# EAGLE schematic TDA2003 (EAGLE 9.4.2)
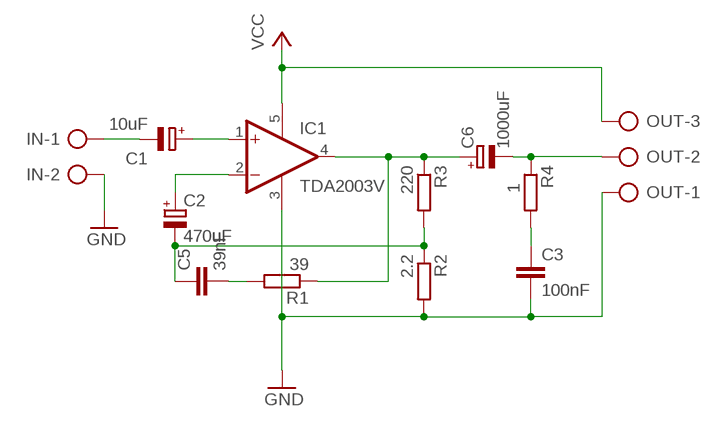
[diagram p0: schematic, sheet 1]

## Parts
C1  10uF  CPOL-EUE2.5-6  [E2,5-6]
C2  470uF  CPOL-EUE5-10.5  [E5-10,5]
C3  100nF  C-EU025-025X050  [C025-025X050]
C5  39nF  C-EU025-025X050  [C025-025X050]
C6  1000uF  CPOL-EUE5-13  [E5-13]
IC1  TDA2003V  [CB360]
IN  AK500/2-H  [AK500/2-H]
OUT  AK500/3-H  [AK500/3-H]
R1  39  R-EU_0207/10  [0207/10]
R2  2.2  R-EU_0207/10  [0207/10]
R3  220  R-EU_0207/10  [0207/10]
R4  1  R-EU_0207/10  [0207/10]

## Nets
GND: C3.2 IC1.3(GND) IN.2 OUT.1 R2.2
N$1: C1.+ IC1.1(+IN)
N$2: C1.- IN.1
N$3: C6.+ IC1.4(OUT) R1.1 R3.1
N$4: C6.- OUT.2 R4.1
N$5: C2.- C5.1 R2.1 R3.2
N$6: C3.1 R4.2
N$7: C2.+ IC1.2(-IN)
N$8: C5.2 R1.2
VCC: IC1.5(V+) OUT.3

## Library data of the parts
C1 C2 C6 = rcl:CPOL-EU: POLARIZED CAPACITOR, European symbol; SPICEPREFIX: C
C3 C5 = rcl:C-EU: CAPACITOR, European symbol; SPICEPREFIX: C
IC1 = linear:TDA2003: AUDIO AMPLIFIER
IN = con-ptr500:AK500/2-H: CONNECTOR Aug. 2004 / PTR Meßtechnik: Die Bezeichnung der Serie AK505 wurde geändert. Es handelt sich hierbei um AK500 in horizontaler Ausführung.; OC_FARNELL: unknown; OC_NEWARK: unknown
OUT = con-ptr500:AK500/3-H: CONNECTOR Aug. 2004 / PTR Meßtechnik: Die Bezeichnung der Serie AK505 wurde geändert. Es handelt sich hierbei um AK500 in horizontaler Ausführung.; OC_FARNELL: unknown; OC_NEWARK: unknown
R1-R4 = rcl:R-EU_: RESISTOR, European symbol; SPICEPREFIX: R